# EAGLE design BusPirate-v4-final (EAGLE 5.06)
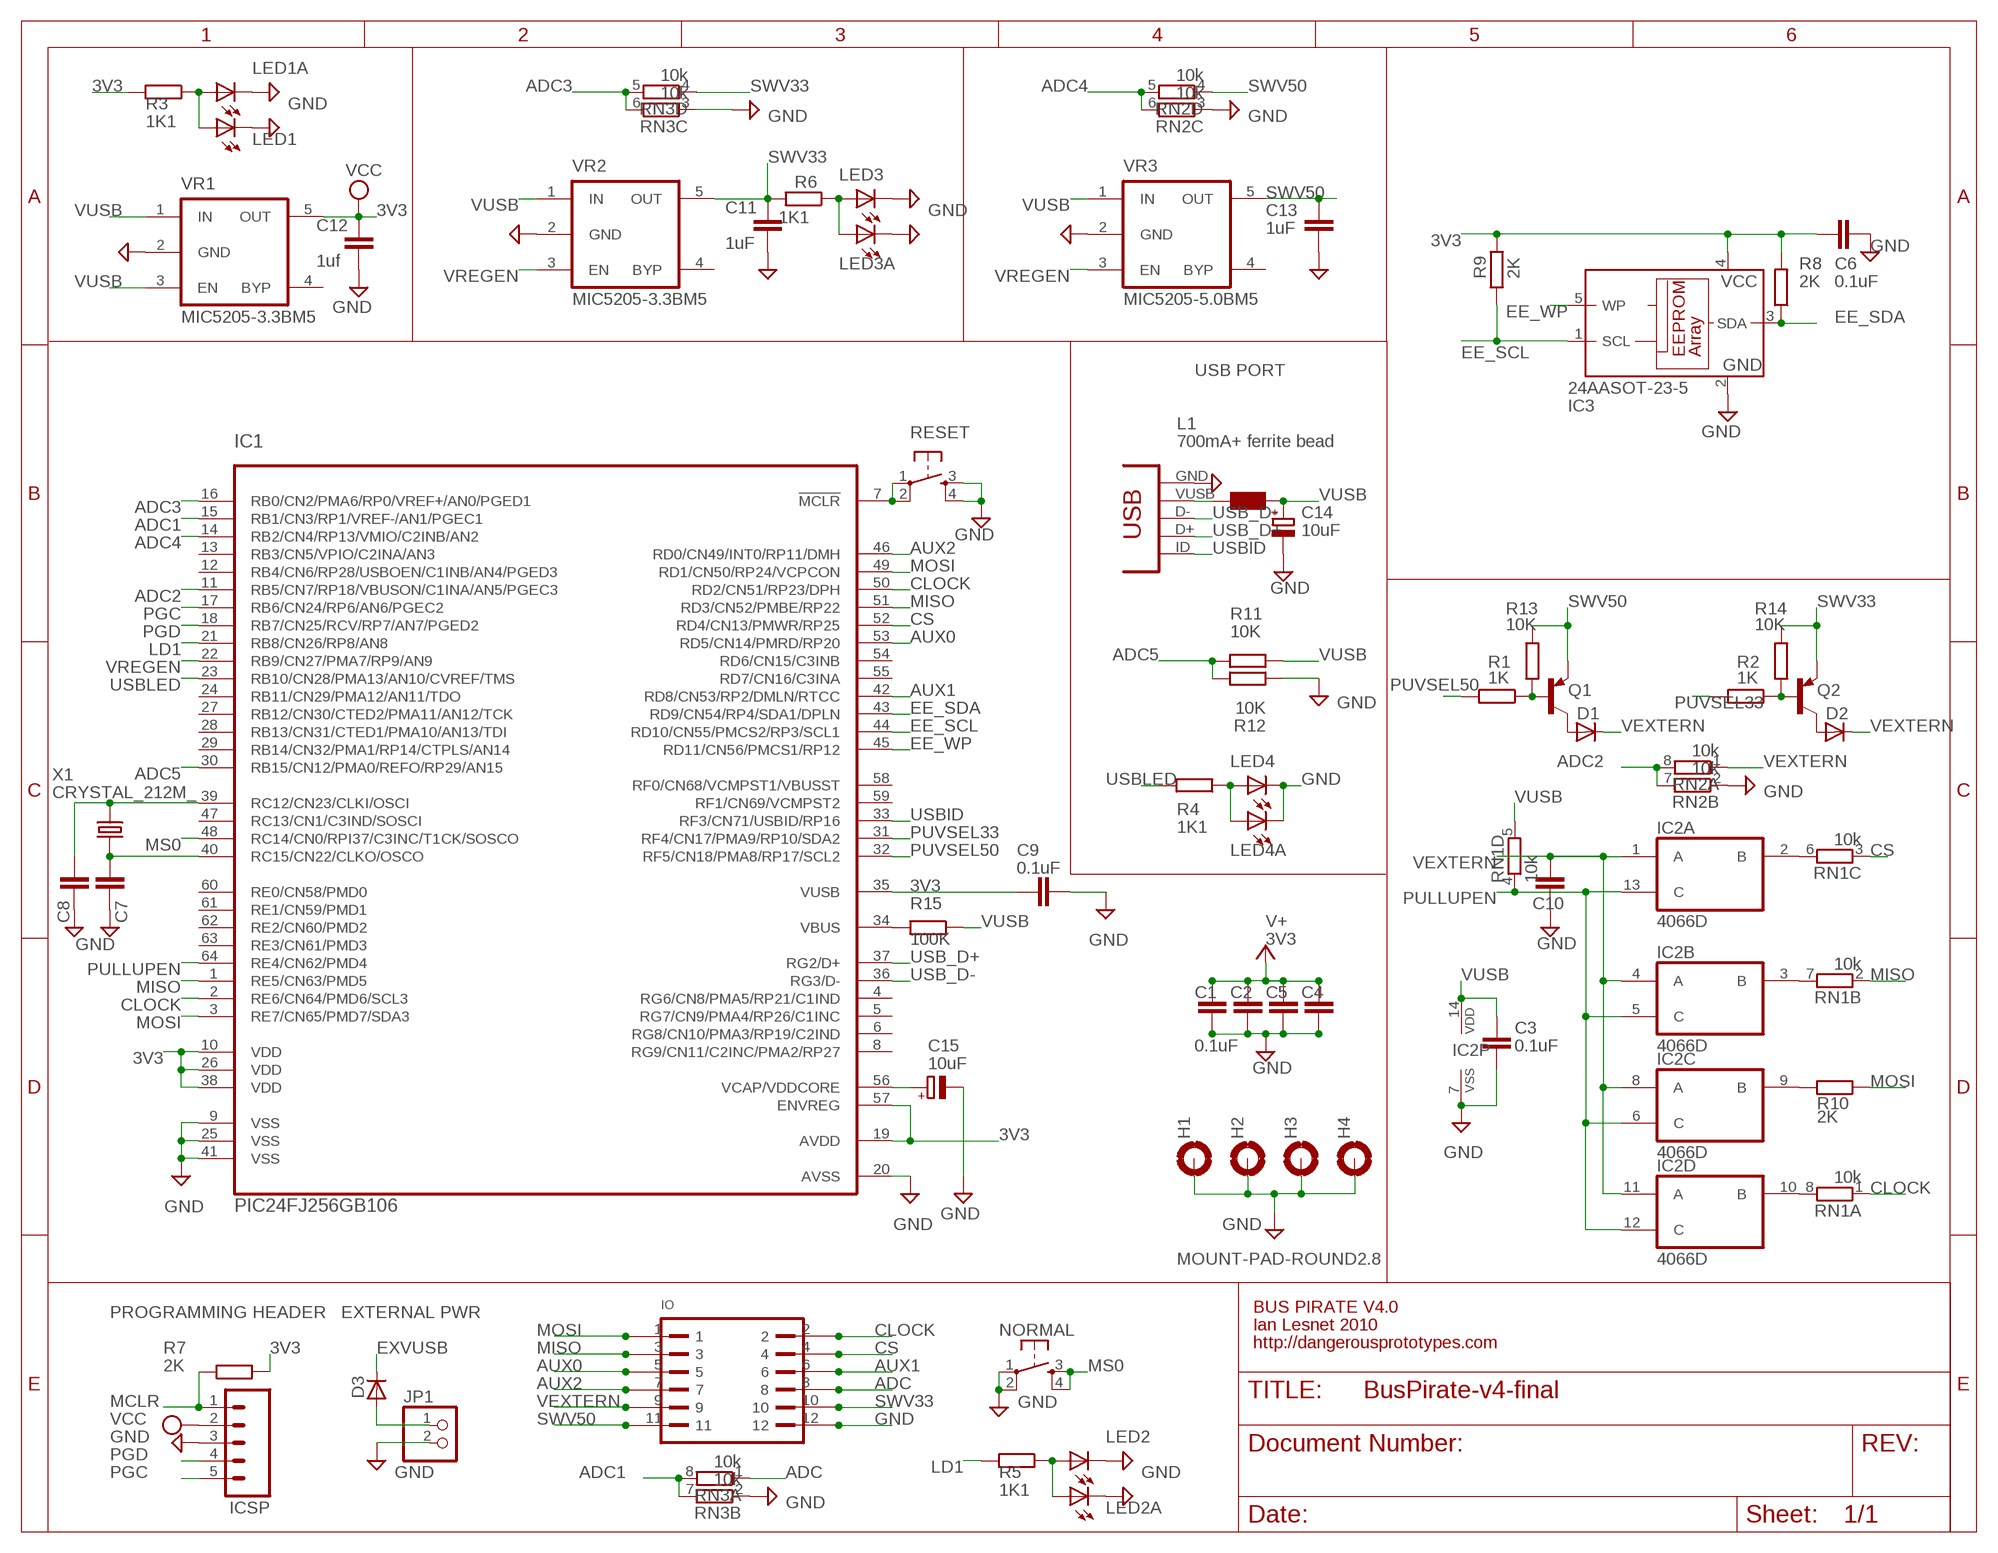
[diagram p0: schematic, sheet 1]

## Parts
C1  0.1uF  C-EUC0603  [C0603]
C2  0.1uF  C-EUC0603  [C0603]
C3  0.1uF  C-EUC0603  [C0603]
C4  0.1uF  C-EUC0603  [C0603]
C5  0.1uF  C-EUC0603  [C0603]
C6  0.1uF  C-EUC0603  [C0603]
C7  0.1uF  C-EUC0603  [C0603]
C8  0.1uF  C-EUC0603  [C0603]
C9  0.1uF  C-EUC0603  [C0603]
C10  0.1uF  C-EUC0603  [C0603]
C11  1uF  C-EUC0603  [C0603]
C12  1uf  C-EUC0603  [C0603]
C13  1uF  C-EUC0603  [C0603]
C14  10uF  CPOL-EUSMCA  [SMC_A]
C15  10uF  CPOL-EUSMCA  [SMC_A]
D1  MBR0520LT  [SOD123]
D2  MBR0520LT  [SOD123]
D3  MBR0520LT  [SOD123]
H1  MOUNT-PAD-ROUND2.8  [2,8-PAD]
H2  MOUNT-PAD-ROUND2.8  [2,8-PAD]
H3  MOUNT-PAD-ROUND2.8  [2,8-PAD]
H4  MOUNT-PAD-ROUND2.8  [2,8-PAD]
IC1  PIC24FJ256GB106  [TQFP64-10X10]
IC2  4066D  [SO14]
IC3  24AASOT-23-5  24AA  [SOT-23-5]
ICSP  ICSP  M05  [1X05]
IO  PINSHRD-PTH-2X06  [PINSHRD_PTH_2X06]
JP1  PINHD-1X02_2.54-S  [1X02-S]
L1  700mA+ ferrite bead  WE-KIL_0805  [WE-KI_0805_B]
LED1  LEDCHIP-LED0805  [CHIP-LED0805]
LED1A  LEDCHIP-LED0805  [CHIP-LED0805]
LED2  LEDCHIP-LED0805  [CHIP-LED0805]
LED2A  LEDCHIP-LED0805  [CHIP-LED0805]
LED3  LEDCHIP-LED0805  [CHIP-LED0805]
LED3A  LEDCHIP-LED0805  [CHIP-LED0805]
LED4  LEDCHIP-LED0805  [CHIP-LED0805]
LED4A  LEDCHIP-LED0805  [CHIP-LED0805]
NORMAL  SMD_TACT_SMALL  [TACT_SWITCH_SMALL]
Q1  MMBTA56-SOT23  [SOT23]
Q2  MMBTA56-SOT23  [SOT23]
R1  1K  R-EU_R0603  [R0603]
R2  1K  R-EU_R0603  [R0603]
R3  1K1  R-EU_R0603  [R0603]
R4  1K1  R-EU_R0603  [R0603]
R5  1K1  R-EU_R0603  [R0603]
R6  1K1  R-EU_R0603  [R0603]
R7  2K  R-EU_R0603  [R0603]
R8  2K  R-EU_R0603  [R0603]
R9  2K  R-EU_R0603  [R0603]
R10  2K  R-EU_R0603  [R0603]
R11  10K  R-EU_R0603  [R0603]
R12  10K  R-EU_R0603  [R0603]
R13  10K  R-EU_R0603  [R0603]
R14  10K  R-EU_R0603  [R0603]
R15  100K  R-EU_R0603  [R0603]
RESET  SMD_TACT_SMALL  [TACT_SWITCH_SMALL]
RN1  10k  RNETWORK  [RN8P-4R-CRA06S]
RN2  10k  RNETWORK  [RN8P-4R-CRA06S]
RN3  10k  RNETWORK  [RN8P-4R-CRA06S]
USB  USB mini-b  CONN_USB  [CONN_USB_MINI-B]
VR1  MIC5205-3.3BM5  MIC5205  [SOT-23-5]
VR2  MIC5205-3.3BM5  MIC5205  [SOT-23-5]
VR3  MIC5205-5.0BM5  MIC5205  [SOT-23-5]
X1  CRYSTAL_212M_  [4X6]

## Nets
3V3: C1.1 C2.1 C4.1 C5.1 C6.1 C9.1 C12.1 IC1.10(VDD) IC1.19(AVDD) IC1.26(VDD) IC1.35(VUSB) IC1.38(VDD) IC1.57(ENVREG) IC3.4(VCC) ICSP.2 R3.2 R7.2 R8.2 R9.2 VR1.5(OUT) ; supply symbol labelled VCC, V+
ADC: IO.8 RN3.1
ADC1: IC1.15(RB1/CN3/RP1/VREF-/AN1/PGEC1) RN3.7 RN3.8
ADC2: IC1.11(RB5/CN7/RP18/VBUSON/C1INA/AN5/PGEC3) RN2.7 RN2.8
ADC3: IC1.16(RB0/CN2/PMA6/RP0/VREF+/AN0/PGED1) RN3.5 RN3.6
ADC4: IC1.14(RB2/CN4/RP13/VMIO/C2INB/AN2) RN2.5 RN2.6
ADC5: IC1.30(RB15/CN12/PMA0/REFO/RP29/AN15) R11.2 R12.2
AUX0: IC1.53(RD5/CN14/PMRD/RP20) IO.5
AUX1: IC1.42(RD8/CN53/RP2/DMLN/RTCC) IO.6
AUX2: IC1.46(RD0/CN49/INT0/RP11/DMH) IO.7
CLOCK: IC1.2(RE6/CN64/PMD6/SCL3) IC1.50(RD2/CN51/RP23/DPH) IO.2 RN1.1
CS: IC1.52(RD4/CN13/PMWR/RP25) IO.4 RN1.3
EE_SCL: IC1.44(RD10/CN55/PMCS2/RP3/SCL1) IC3.1(SCL) R9.1
EE_SDA: IC1.43(RD9/CN54/RP4/SDA1/DPLN) IC3.3(SDA) R8.1
EE_WP: IC1.45(RD11/CN56/PMCS1/RP12) IC3.5(WP)
EXVUSB: D3.C L1.2 USB.VUSB
GND: C1.2 C2.2 C3.2 C4.2 C5.2 C6.2 C7.2 C8.2 C9.2 C10.2 C11.2 C12.2 C13.2 C14.- C15.- H1.B2,8(MOUNT) H2.B2,8(MOUNT) H3.B2,8(MOUNT) H4.B2,8(MOUNT) IC1.9(VSS) IC1.20(AVSS) IC1.25(VSS) IC1.41(VSS) IC2.7(P:VSS) IC3.2(GND) ICSP.3 IO.12 JP1.2 LED1.C LED1A.C LED2.C LED2A.C LED3.C LED3A.C LED4.C LED4A.C NORMAL.1 NORMAL.2 R12.1 RESET.3 RESET.4 RN2.2 RN2.3 RN3.2 RN3.3 USB.GND VR1.2(GND) VR2.2(GND) VR3.2(GND)
LD1: IC1.21(RB8/CN26/RP8/AN8) R5.2
MCLR: IC1.7(!MCLR) ICSP.1 R7.1 RESET.1 RESET.2
MISO: IC1.1(RE5/CN63/PMD5) IC1.51(RD3/CN52/PMBE/RP22) IO.3 RN1.2
MOSI: IC1.3(RE7/CN65/PMD7/SDA3) IC1.49(RD1/CN50/RP24/VCPCON) IO.1 R10.1
MS0: IC1.48(RC14/CN0/RPI37/C3INC/T1CK/SOSCO) NORMAL.3 NORMAL.4
N$1: IC2.9(C:B) R10.2
N$2: IC2.10(D:B) RN1.8
N$3: D1.A Q1.3(C)
N$4: IC2.2(A:B) RN1.6
N$5: IC2.3(B:B) RN1.7
N$6: LED2.A LED2A.A R5.1
N$7: LED1.A LED1A.A R3.1
N$8: Q2.1(B) R2.1 R14.2
N$9: C7.1 IC1.40(RC15/CN22/CLKO/OSCO) X1.2(X2)
N$10: C15.+ IC1.56(VCAP/VDDCORE)
N$11: IC1.34(VBUS) R15.2
N$12: C8.1 IC1.39(RC12/CN23/CLKI/OSCI) X1.1(X1)
N$13: LED4.A LED4A.A R4.1
N$14: D2.A Q2.3(C)
N$15: D3.A JP1.1
N$17: Q1.1(B) R1.1 R13.2
N$18: LED3.A LED3A.A R6.1
PGC: IC1.17(RB6/CN24/RP6/AN6/PGEC2) ICSP.5
PGD: IC1.18(RB7/CN25/RCV/RP7/AN7/PGED2) ICSP.4
PULLUPEN: IC1.64(RE4/CN62/PMD4) IC2.5(B:C) IC2.6(C:C) IC2.12(D:C) IC2.13(A:C) RN1.4
PUVSEL33: IC1.31(RF4/CN17/PMA9/RP10/SDA2) R2.2
PUVSEL50: IC1.32(RF5/CN18/PMA8/RP17/SCL2) R1.2
SWV33: C11.1 IO.10 Q2.2(E) R6.2 R14.1 RN3.4 VR2.5(OUT)
SWV50: C13.1 IO.11 Q1.2(E) R13.1 RN2.4 VR3.5(OUT)
USB_D+: IC1.37(RG2/D+) USB.D+
USB_D-: IC1.36(RG3/D-) USB.D-
USBID: IC1.33(RF3/CN71/USBID/RP16) USB.ID(USBID)
USBLED: IC1.23(RB10/CN28/PMA13/AN10/CVREF/TMS) R4.2
VEXTERN: C10.1 D1.C D2.C IC2.1(A:A) IC2.4(B:A) IC2.8(C:A) IC2.11(D:A) IO.9 RN2.1
VREGEN: IC1.22(RB9/CN27/PMA7/RP9/AN9) VR2.3(EN) VR3.3(EN)
VUSB: C3.1 C14.+ IC2.14(P:VDD) L1.1 R11.1 R15.1 RN1.5 VR1.1(IN) VR1.3(EN) VR2.1(IN) VR3.1(IN)
Unconnected: IC1.4(RG6/CN8/PMA5/RP21/C1IND) IC1.5(RG7/CN9/PMA4/RP26/C1INC) IC1.6(RG8/CN10/PMA3/RP19/C2IND) IC1.8(RG9/CN11/C2INC/PMA2/RP27) IC1.12(RB4/CN6/RP28/USBOEN/C1INB/AN4/PGED3) IC1.13(RB3/CN5/VPIO/C2INA/AN3) IC1.24(RB11/CN29/PMA12/AN11/TDO) IC1.27(RB12/CN30/CTED2/PMA11/AN12/TCK) IC1.28(RB13/CN31/CTED1/PMA10/AN13/TDI) IC1.29(RB14/CN32/PMA1/RP14/CTPLS/AN14) IC1.47(RC13/CN1/C3IND/SOSCI) IC1.54(RD6/CN15/C3INB) IC1.55(RD7/CN16/C3INA) IC1.58(RF0/CN68/VCMPST1/VBUSST) IC1.59(RF1/CN69/VCMPST2) IC1.60(RE0/CN58/PMD0) IC1.61(RE1/CN59/PMD1) IC1.62(RE2/CN60/PMD2) IC1.63(RE3/CN61/PMD3) USB.BODY@1(BODY) USB.BODY@2(BODY) USB.BODY@3(BODY) USB.BODY@4(BODY) VR1.4(BYP) VR2.4(BYP) VR3.4(BYP)

## Notes on the sheet
- USB PORT
- BUS PIRATE V4.0
- PROGRAMMING HEADER | EXTERNAL PWR
- Ian Lesnet 2010
- http://dangerousprototypes.com

## Library data of the parts
C1-C13 = rcl:C-EU: CAPACITOR, European symbol
C14 C15 = rcl:CPOL-EU: POLARIZED CAPACITOR, European symbol
D1-D3 = diode:MBR0520LT: SCHOTTKY BARRIER RECTIFIER Source: http://onsemi.com .. MBR0520LT1-D.pdf
H1-H4 = holes:MOUNT-PAD-ROUND: MOUNTING PAD, round
IC1 = dp_devices:PIC24FJ256GB106: 16-Bit Flash Microcontroller with USB On-The-Go(OTG)
IC2 = 40xx:4066: Quad bilateral ANALOG SWITCH
IC3 = dp_devices:24AA*; 24AA: 24AA
ICSP = SparkFun:M05: Header 5 Standard 5-pin 0.1" header. Use with straight break away headers (SKU : PRT-00116), right angle break away headers (PRT-00553), swiss pins (PRT-00743), machine pins (PRT-00117), and female headers (PRT-00115). Molex polarized connector foot print use with SKU : PRT-08230 with associated crimp pins and housings.
IO = dp_devices:PINSHRD-PTH-2X06: Shrouded pin header, 2.54mm pitch
JP1 = pinhead-2:PINHD-1X02: PIN HEADER
L1 = wuerth-elektronik:WE-KIL: SMD Wire Wound Ceramic Inductor WE-KIL - Low profile - High Q values -- Bluetooth -- Wireless LAN -- RF oscillation circuit -- IF impedance matching
LED1 LED1A LED2 LED2A LED3 LED3A LED4 LED4A = led:LED: LED OSRAM: - CHIPLED LG R971, LG N971, LY N971, LG Q971, LY Q971, LO R971, LY R971 LH N974, LH R974 LS Q976, LO Q976, LY Q976 LO Q996 - Hyper CHIPLED LW Q18S LB Q993, LB Q99A, LB R99A - SideLED LS A670, LO A670, LY A670, LG A670, LP A670 LB A673, LV A673, LT A673, LW A673 LH A674 LY A675 LS A676, LA A676, LO A676, LY A676, LW A676 LS A679, LY A679, LG A679 - Hyper Micro SIDELED® LS Y876, LA Y876, LO Y876, LY Y876 LT Y87S - SmartLED LW L88C, LW L88S LB L89C, LB L89S, LG L890 LS L89K, LO L89K, LY L89K LS L896, LA L896, LO L896, LY L896 - TOPLED LS T670, LO T670, LY T670, LG T670, LP T670 LSG T670, LSP T670, LSY T670, LOP T670, LYG T670 LG T671, LOG T671, LSG T671 LB T673, LV T673, LT T673, LW T673 LH T674 LS T676, LA T676, LO T676, LY T676, LB T676, LH T676, LSB T676, LW T676 LB T67C, LV T67C, LT T67C, LS T67K, LO T67K, LY T67K, LW E67C LS E67B, LA E67B, LO E67B, LY E67B, LB E67C, LV E67C, LT E67C LW T67C LS T679, LY T679, LG T679 LS T770, LO T770, LY T770, LG T770, LP T770 LB T773, LV T773, LT T773, LW T773 LH T774 LS E675, LA E675, LY E675, LS T675 LS T776, LA T776, LO T776, LY T776, LB T776 LHGB T686 LT T68C, LB T68C - Hyper Mini TOPLED® LB M676 - Mini TOPLED Santana® LG M470 LS M47K, LO M47K, LY M47K Source: http://www.osram.convergy.de LUXEON: - LUMILED® LXK2-PW12-R00, LXK2-PW12-S00, LXK2-PW14-U00, LXK2-PW14-V00 LXK2-PM12-R00, LXK2-PM12-S00, LXK2-PM14-U00 LXK2-PE12-Q00, LXK2-PE12-R00, LXK2-PE12-S00, LXK2-PE14-T00, LXK2-PE14-U00 LXK2-PB12-K00, LXK2-PB12-L00, LXK2-PB12-M00, LXK2-PB14-N00, LXK2-PB14-P00, LXK2-PB14-Q00 LXK2-PR12-L00, LXK2-PR12-M00, LXK2-PR14-Q00, LXK2-PR14-R00 LXK2-PD12-Q00, LXK2-PD12-R00, LXK2-PD12-S00 LXK2-PH12-R00, LXK2-PH12-S00 LXK2-PL12-P00, LXK2-PL12-Q00, LXK2-PL12-R00 Source: www.luxeon.com KINGBRIGHT: KA-3528ASYC Source: www.kingbright.com
NORMAL RESET = dp_devices:SMD_TACT_SMALL
Q1 Q2 = transistor-pnp:*-?: PNP Transistor
R1-R3 R5-R10 R13-R15 = rcl:R-EU_: RESISTOR, European symbol
R4 R11 R12 = resistor:R-EU_: RESISTOR, European symbol
RN1-RN3 = dp_devices:RNETWORK: 4 Resistor Array 0603
USB = dp_devices:CONN_USB: USB connector
VR1-VR3 = dp_devices:MIC5205: 150ma Low-Noise LDO Regulator
X1 = dp_devices:CRYSTAL_2

## Board
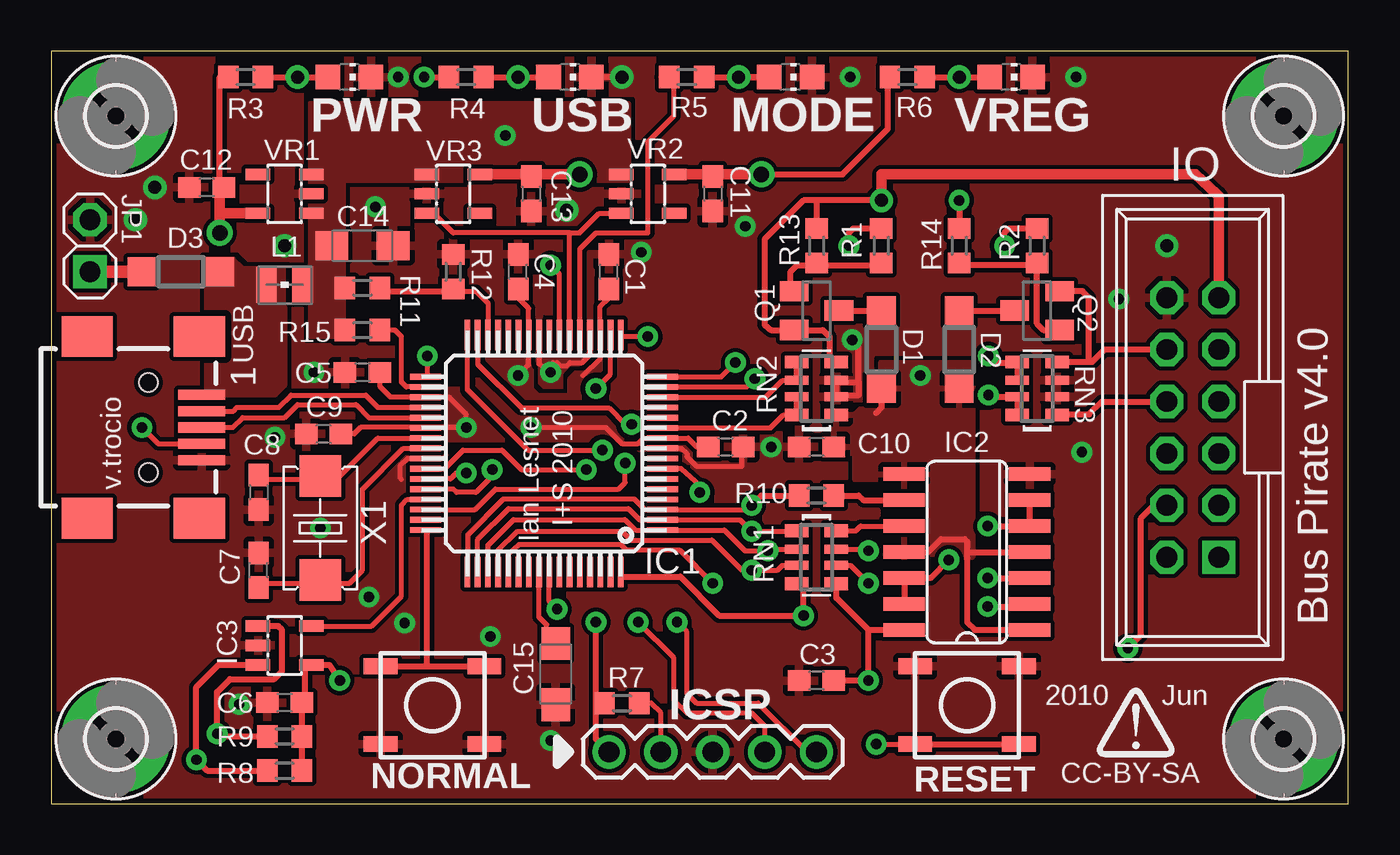
[diagram p1: board, top side]
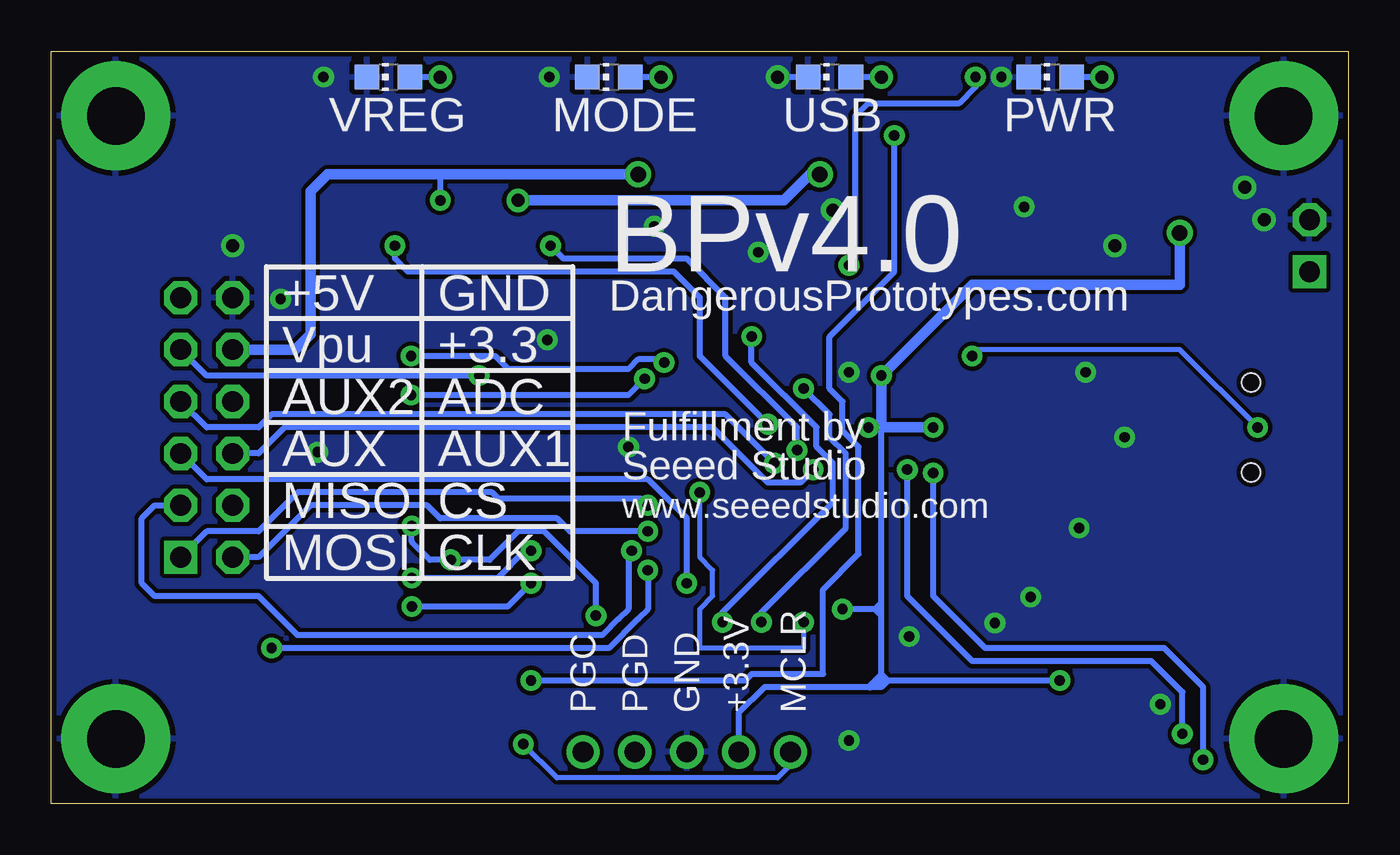
[diagram p2: board, bottom side, seen from below]

Size 63.5 x 36.83 mm. Coordinates in mm from the lower left corner, seen from the top.
Outline: 0,36.83 0,0 63.5,0 63.5,36.83 0,36.83
Copper layers (1*16): Top 0.035mm / dielectric 1.5mm / Bottom 0.035mm
Design rules "SparkFun": minimum track width 8mil, minimum drill 20mil, track to track 8mil, track to pad 8mil, pad to pad 8mil, via to via 8mil, smd to smd 8mil, copper to edge 10mil, drill to drill 8mil, minimum pad ring 12mil, minimum via ring 10mil, stop-mask expansion 4mil, vias tented up to drill 25mil, thermal gap 10mil

### Footprints (pad centres in the part's own frame; a part is rotated, then mirrored left to right if it is on the bottom)
C0603 = smd 1.1 x 1: 1 -0.85,0; 2 0.85,0
SMC_A = smd 1.6 x 1.4: + -1.5,0; - 1.5,0
SOD123 = smd 1.4 x 1.4: A 1.9,0; C -1.9,0
2,8-PAD = drill 2.8 pad 5.334 round: B2,8 0,0
TQFP64-10X10 = smd 1.5 x 0.28: 1 -5.8,3.75; 2 -5.8,3.25; 3 -5.8,2.75; 4 -5.8,2.25; 5 -5.8,1.75; 6 -5.8,1.25; 7 -5.8,0.75; 8 -5.8,0.25; 9 -5.8,-0.25; 10 -5.8,-0.75; 11 -5.8,-1.25; 12 -5.8,-1.75; 13 -5.8,-2.25; 14 -5.8,-2.75; 15 -5.8,-3.25; 16 -5.8,-3.75; 33 5.8,-3.75; 34 5.8,-3.25; 35 5.8,-2.75; 36 5.8,-2.25; 37 5.8,-1.75; 38 5.8,-1.25; 39 5.8,-0.75; 40 5.8,-0.25; 41 5.8,0.25; 42 5.8,0.75; 43 5.8,1.25; 44 5.8,1.75; 45 5.8,2.25; 46 5.8,2.75; 47 5.8,3.25; 48 5.8,3.75 | smd 0.28 x 1.5: 17 -3.75,-5.8; 18 -3.25,-5.8; 19 -2.75,-5.8; 20 -2.25,-5.8; 21 -1.75,-5.8; 22 -1.25,-5.8; 23 -0.75,-5.8; 24 -0.25,-5.8; 25 0.25,-5.8; 26 0.75,-5.8; 27 1.25,-5.8; 28 1.75,-5.8; 29 2.25,-5.8; 30 2.75,-5.8; 31 3.25,-5.8; 32 3.75,-5.8; 49 3.75,5.8; 50 3.25,5.8; 51 2.75,5.8; 52 2.25,5.8; 53 1.75,5.8; 54 1.25,5.8; 55 0.75,5.8; 56 0.25,5.8; 57 -0.25,5.8; 58 -0.75,5.8; 59 -1.25,5.8; 60 -1.75,5.8; 61 -2.25,5.8; 62 -2.75,5.8; 63 -3.25,5.8; 64 -3.75,5.8
SO14 = smd 0.66 x 2.032: 1 -3.81,-3.073; 2 -2.54,-3.073; 3 -1.27,-3.073; 4 0,-3.073; 5 1.27,-3.073; 6 2.54,-3.073; 7 3.81,-3.073; 8 3.81,3.073; 9 2.54,3.073; 10 1.27,3.073; 11 0,3.073; 12 -1.27,3.073; 13 -2.54,3.073; 14 -3.81,3.073
SOT-23-5 = smd 0.55 x 1.2: 1 -0.95,-1.3; 2 0,-1.3; 3 0.95,-1.3; 4 0.95,1.3; 5 -0.95,1.3
1X05 = drill 1.016 round: 1 0,0; 2 2.54,0; 3 5.08,0; 4 7.62,0; 5 10.16,0
PINSHRD_PTH_2X06 = drill 1.016 square: 1 -6.35,-1.27 | drill 1.016 octagon: 2 -6.35,1.27; 3 -3.81,-1.27; 4 -3.81,1.27; 5 -1.27,-1.27; 6 -1.27,1.27; 7 1.27,-1.27; 8 1.27,1.27; 9 3.81,-1.27; 10 3.81,1.27; 11 6.35,-1.27; 12 6.35,1.27
1X02-S = drill 1.016 square: 1 -1.27,0 | drill 1.016 octagon: 2 1.27,0
WE-KI_0805_B = smd 1.02 x 1.78: 1 -0.89,0; 2 0.89,0
CHIP-LED0805 = smd 1.2 x 1.2: A 0,-1.05; C 0,1.05
TACT_SWITCH_SMALL = smd 1.651 x 0.762: 1 -2.54,1.905; 2 2.54,1.905; 3 -2.54,-1.905; 4 2.54,-1.905
SOT23 = smd 1 x 1.4: 1 -0.95,-1.1; 2 0.95,-1.1; 3 0,1.1
R0603 = smd 1 x 1.1: 1 -0.85,0; 2 0.85,0
RN8P-4R-CRA06S = smd 0.63 x 1.15: 1 -1.295,-0.975; 4 1.295,-0.975; 5 1.295,0.975; 8 -1.295,0.975 | smd 0.44 x 1.15: 2 -0.4,-0.975; 3 0.4,-0.975; 6 0.4,0.975; 7 -0.4,0.975
CONN_USB_MINI-B = smd 2 x 2.5: BODY@1 -4.45,2.5; BODY@2 4.45,2.5; BODY@3 4.45,-3; BODY@4 -4.45,-3 | smd 0.5 x 2.3: D+ 0,2.6; D- -0.8,2.6; GND 1.6,2.6; ID 0.8,2.6; VUSB -1.6,2.6 | hole 0.9: -2.2,0; 2.2,0
4X6 = smd 2.032 x 2.032: 1 -2.54,0; 2 2.54,0

### Placement (x,y rotation side)
C1  27.3,26.04 90 top
C2  33.02,17.46 0 top
C3  37.46,6.03 180 top
C4  22.86,26.04 90 top
C5  15.24,21.11 180 top
C6  11.43,4.95 180 top
C7  10.16,11.43 90 top
C8  10.16,15.24 270 top
C9  13.34,18.1 180 top
C10  37.46,17.46 180 top
C11  32.38,29.85 270 top
C12  7.62,30.16 180 top
C13  23.49,29.85 270 top
C14  15.24,27.31 0 top
C15  24.7,6.35 270 top
D1  40.64,22.23 90 top
D2  44.45,22.23 90 top
D3  6.35,26.04 180 top
H1  3.17,3.17 0 top
H2  60.32,3.17 0 top
H3  60.32,33.66 0 top
H4  3.17,33.66 0 top
IC1  24.13,17.15 180 top
IC2  44.83,12.32 90 top
IC3  11.43,7.75 270 top
ICSP  27.3,2.54 0 top
IO  55.88,18.42 90 top
JP1  1.91,27.31 90 top
L1  11.43,25.4 180 top
LED1  14.61,35.56 270 top
LED1A  14.61,35.56 90 bottom
LED2  36.2,35.56 270 top
LED2A  36.2,35.56 90 bottom
LED3  46.99,35.56 270 top
LED3A  46.99,35.56 90 bottom
LED4  25.4,35.56 270 top
LED4A  25.4,35.56 90 bottom
NORMAL  18.67,4.83 180 top
Q1  37.46,24.13 270 top
Q2  48.26,24.13 90 top
R1  40.64,27.31 90 top
R2  48.26,27.31 90 top
R3  9.53,35.56 180 top
R4  20.32,35.56 180 top
R5  31.12,35.56 180 top
R6  41.91,35.56 180 top
R7  27.94,4.92 0 top
R8  11.43,1.62 0 top
R9  11.43,3.3 0 top
R10  37.46,15.08 0 top
R11  15.24,25.24 0 top
R12  19.68,26.04 270 top
R13  37.46,27.31 270 top
R14  44.45,27.31 270 top
R15  15.24,23.18 0 top
RESET  44.83,4.83 180 top
RN1  37.46,12.06 270 top
RN2  37.46,20.32 90 top
RN3  48.26,20.32 90 top
U$1  [DP-LOGO]  51.18,2.29 0 top
USB  4.76,18.42 270 top
VR1  11.43,29.85 90 top
VR2  29.21,29.85 270 top
VR3  19.68,29.85 270 top
X1  13.18,13.49 270 top

### Tracks (layer width: path | path; a pad name or v marks a point on that pad's centre or on a via)
3V3  (via drill 0.51, 0.76)
  Top 0.254: 16.03,20.96 C5.1 16.11,21.09 16.11,20.4 16.62,19.9 IC1.35 19.47,19.9 20.32,19.05 v20.32,18.42 | C1.1 27.3,24.77 26.88,24.34 IC1.19 26.88,21.76 26.04,20.96 | C4.1 22.86,24.77 23.38,24.25 IC1.26 23.38,21.48 v22.86,20.96 | C2.1 31.59,17.46 31.18,17.9 IC1.10 29.01,17.9 28.73,17.62 27.94,17.62 27.15,18.42 v23.49,18.42 | R7.2 29.37,4.92 29.84,4.45 ICSP.2 | C9.1 14.84,18.1 15.16,18.42 20.16,18.42 v20.32,18.42 | IC1.38 20.14,18.4 v20.32,18.42 | IC1.57 24.38,9.91 v24.77,9.53
  Top 0.305: 8.89,35.56 R3.2 8.26,35.56 8.26,30.16 | v14.13,6.03 13.62,6.8 IC3.4 12.45,6.77 12.45,5.21 12.28,5.04 C6.1 R9.2 | R9.2 | R8.2 R9.2
  Top 0.508: v8.26,27.94 8.26,28.26 8.25,28.9 VR1.5 8.54,28.89 8.26,28.89 8.26,30.16 C12.1
  Bottom 0.305: 22.86,9.53 22.86,9.84 | 22.86,9.84 22.86,18.42 | v14.13,6.03 22.54,6.03 | 22.54,6.03 22.86,6.03 | ICSP.2 29.84,4.45 28.57,5.71 23.49,5.71 | 22.86,5.71 23.18,5.71 | 23.18,5.71 23.34,5.71 | 22.86,9.53 23.18,9.53 | 23.18,9.53 v24.77,9.53 | 22.86,6.03 22.86,6.19 | 22.86,6.35 22.86,6.19 | 22.86,6.35 22.86,9.21 | 22.86,9.21 22.86,9.53 | 22.86,6.03 22.86,5.71 | 22.86,6.03 23.18,5.71 | 22.54,6.03 22.86,6.35 | 22.54,6.03 22.86,5.71 | 22.86,6.19 23.34,5.71 | 23.49,5.71 23.34,5.71 | 22.86,6.35 23.49,5.71 | 23.18,9.53 22.86,9.84 | 22.86,9.21 23.18,9.53
  Bottom 0.508: v8.26,27.94 8.26,25.4 18.41,25.4 v22.86,20.96 | 22.86,18.42 v22.86,20.96 | 22.86,18.42 v20.32,18.42 | v22.86,20.96 | 22.86,18.42 v23.49,18.42 | 22.86,18.42 v22.86,20.96
  pour Top (isolate 0.254, no thermals): 20.32,24.13 22.86,24.13 23.49,23.5 23.49,20.32 23.81,20 25.4,20 25.4,20.8 26.19,21.59 28.57,21.59 28.57,17.78 18.41,17.78 18.41,20.32 20.32,20.32
ADC
  Top 0.305: IO.8 51.44,19.69 50.8,19.05 49.53,19.05 49.5,19.03 RN3.1
ADC1  (via drill 0.51)
  Top 0.254: IC1.15 34.05,20.4 v34.45,20.8
  Top 0.305: RN3.8 RN3.7 45.96,19.92 v45.88,20
  Bottom 0.305: v45.88,20 35.24,20 v34.45,20.8 | v34.45,20.8
ADC2
  Top 0.254: IC1.11 35.22,18.4 35.85,19.03 RN2.8 RN2.7
ADC3  (via drill 0.51)
  Top 0.254: IC1.16 32.8,20.9 v33.5,21.59
  Top 0.305: 47.56,21.59 47.31,21.59 RN3.5 | RN3.5 RN3.6 | RN3.5 | RN3.5 47.01,21.61 46.99,21.59 46.2,21.59 v45.88,21.91
  Bottom 0.305: v33.5,21.59 | v33.5,21.59 33.66,21.75 34.77,21.75 35.24,21.27 41.12,21.27 41.75,21.91 v45.88,21.91
ADC4
  Top 0.254: RN2.5 RN2.6 35.8,20.72 34.98,19.9 IC1.14
ADC5
  Top 0.254: IC1.30 21.38,24.5 20.8,25.08 19.79,25.08 R12.2
  Top 0.305: R11.2 16.09,25.19 16.19,25.08 19.58,25.08 R12.2
AUX0  (via drill 0.51)
  Top 0.254: IC1.53 22.38,12.22 22.9,12.7 27.86,12.7 28.14,12.42 30.76,12.42 v32.38,10.79
  Bottom 0.305: v32.38,10.79 32.38,13.97 34.29,15.88 55.88,15.88 IO.5
AUX1  (via drill 0.51)
  Top 0.254: IC1.42 19.25,16.39 20.16,17.3 22.07,17.3 23.02,16.35 v26.19,16.35
  Bottom 0.305: IO.6 53.34,17.15 52.07,18.42 31.12,18.42 28.42,15.72 26.83,15.72 v26.19,16.35
AUX2  (via drill 0.51)
  Top 0.254: IC1.46 20.74,14.39 21.75,15.4 27.78,15.4 28.1,15.72 v28.1,16.67
  Bottom 0.305: IO.7 55.88,18.42 53.34,18.42 52.7,19.05 30.48,19.05 v28.1,16.67
CLOCK  (via drill 0.51)
  Top 0.254: IC1.50 20.88,12.94 22.38,14.45 28.26,14.45 28.81,13.89 IC1.2 33.73,13.89 v34.29,13.33 36.04,13.33 36.06,13.36 RN1.1 36.39,13.27 36.27,13.27 36.2,13.33
  Bottom 0.305: v34.29,13.33 38.1,13.33 38.73,13.97 44.45,13.97 45.09,14.61 50.8,14.61 53.34,12.06 IO.2
CS  (via drill 0.51)
  Top 0.254: IC1.52 21.88,12.43 22.82,13.33 27.94,13.33 28.38,12.9 32.34,12.9 33.81,11.43 v34.29,11.43 35.56,11.43 35.8,11.66 RN1.3
  Top 0.305: IO.4 53.98,14.61 53.34,13.97 53.34,8.26 v52.7,7.62
  Bottom 0.305: v52.7,7.62 36.2,7.62 34.77,9.05 | 34.77,9.05 | 34.77,9.05 34.29,9.53 v34.29,11.43
EE_SCL  (via drill 0.51)
  Top 0.254: IC1.44 19.69,15.39 19.84,15.24 20.8,15.24 21.59,16.03 v21.59,16.35
  Top 0.305: R9.1 8.26,3.3 v8.13,3.43 8.13,5.46 8.76,6.1 10.92,6.1 11.3,6.48 11.3,8.51 11.12,8.7 IC3.1
  Bottom 0.305: v8.13,3.43 8.13,5.46 9.65,6.98 18.41,6.98 21.59,10.16 v21.59,16.35
EE_SDA  (via drill 0.51)
  Top 0.254: IC1.43 19.55,15.89 19.84,16.19 v20.32,16.19
  Top 0.305: R8.1 7.65,1.62 v7.11,2.16 7.11,5.71 8.19,6.8 IC3.3
  Bottom 0.305: v7.11,2.16 7.11,5.71 9.02,7.62 17.78,7.62 20.32,10.16 v20.32,16.19
EE_WP
  Top 0.254: IC1.45 17.43,14.89 17.14,14.61 17.14,10.16 15.68,8.7 IC3.5
EXVUSB
  pour Top (isolate 0.305, no thermals): 7.62,21.59 8.89,21.59 8.89,24.13 7.62,24.13 7.62,26.67 8.89,26.67 9.37,26.19 11.43,26.19 11.43,20.48 10.95,20 7.62,20
GND  (via drill 0.51, 0.64)
  Top 0.254: IC1.25 23.88,21.52 v24.45,21.11 24.45,21.47 24.57,21.59 24.77,21.59 24.92,21.43 25.24,21.43 25.4,21.59 25.99,21.59 26.38,21.98 IC1.20 | IC1.41 17.45,16.9 17.07,16.51 17.07,15.95 17.14,15.88 | IC1.9 30.87,17.4 31.12,17.15 31.12,16.99 31.59,16.51 33.81,16.51 33.81,17.41 C2.2
  Top 0.305: v39.21,22.7 39.53,22.7 39.53,20.64 | 39.53,20.64 39.53,20 38.42,20 38.42,20.64 39.53,20.64 | v27.94,35.56 LED4A.C
  Top 0.406: LED4A.C 26.04,35.56
  Bottom 0.254: LED4A.C 26.35,35.56
  Bottom 0.305: LED4A.C v27.94,35.56
  other vias: 50.45,17.21 50.16,35.56 33.97,28.26 39.12,35.56 15.88,29.21 16.99,35.56 28.89,26.99 5.08,30.16 54.61,27.31 35.24,17.46 25.24,29.05 12.86,21.11 11.43,27.31 21.49,8.19 10.95,17.94 13.18,13.49 15.56,10.12 24.45,3.1 4.13,28.58 17.3,8.85 52.26,24.7 9.21,4.87
  pour Top (isolate 0.203, rank 2): 0,36.83 63.5,36.83 63.5,0 0,0
  pour Bottom (isolate 0.203, rank 2): 0,36.83 63.5,36.83 arc-3 63.5,0 0,0
LD1
  Top 0.254: IC1.21 25.88,27.15 26.67,27.94 29.21,27.94 29.21,32.38 30.48,33.66 30.48,35.22 R5.2 29.84,35.56
MCLR  (via drill 0.51)
  Top 0.254: IC1.7 30.84,16.39 31.75,15.56 v31.75,15.24 | R7.1 26.83,4.92 26.67,5.08 | v40.39,2.92 RESET.2
  Top 0.305: v26.67,8.89 26.67,5.08 26.67,3.17 ICSP.1 | RESET.2 RESET.1
  Bottom 0.254: v31.75,15.24 31.75,12.06 31.12,11.43 31.12,10.16 31.75,9.53 31.75,7.62 26.67,7.62 v26.67,8.89 | v40.39,2.92 38.73,1.27 27.94,1.27 27.3,1.91 ICSP.1
MISO  (via drill 0.51)
  Top 0.254: IC1.51 21.38,12.66 22.63,13.91 28.08,13.91 28.59,13.39 IC1.1 32.96,13.39 33.97,12.38 v35.08,12.38 35.17,12.46 RN1.2
  Bottom 0.305: IO.3 58.42,14.61 59.05,13.97 59.05,10.79 58.42,10.16 53.34,10.16 51.44,8.26 36.51,8.26 35.72,9.05 | 35.72,9.05 | 35.72,9.05 35.24,9.53 35.24,12.22 v35.08,12.38
MOSI  (via drill 0.51)
  Top 0.254: v34.29,14.61 34.08,14.39 IC1.3 29.06,14.39 28.54,14.92 22.15,14.92 20.4,13.18 20.4,11.39 20.38,11.33 IC1.49
  Top 0.305: R10.1 34.77,15.08 v34.29,14.61
  Bottom 0.305: IO.1 55.88,13.33 53.34,13.33 51.44,15.24 41.91,15.24 41.59,14.92 34.61,14.92 v34.29,14.61
MS0
  Top 0.254: 18.41,13.38 18.34,13.38 IC1.48
  Top 0.305: NORMAL.4 18.41,6.73 | 18.41,6.73 NORMAL.3 | 18.41,6.73 18.41,13.38
N$1
  Top 0.305: IC2.9 39.75,14.86 39.53,15.08 R10.2
N$2
  Top 0.254: IC2.10 39.62,13.59 39.39,13.36 RN1.8
N$3
  Top 0.305: Q1.3 D1.A
N$4  (via drill 0.51)
  Top 0.254: 47.78,9.65 IC2.2 | RN1.6 39.13,11.66 v40,10.79
  Top 0.305: v45.85,9.65 47.78,9.65
  Bottom 0.305: v45.85,9.65 41.15,9.65 v40,10.79
N$5  (via drill 0.51)
  Top 0.254: IC2.3 47.78,10.92 | RN1.7 39.92,12.46 v40,12.38
  Top 0.305: v45.85,11.05 IC2.3
  Bottom 0.305: v45.85,11.05 41.66,11.05 40.32,12.38 v40,12.38
N$6  (via drill 0.64)
  Top 0.305: v33.66,35.56 LED2A.A R5.1
  Top 0.406: R5.1 32.1,35.53
  Bottom 0.305: v33.66,35.56 LED2A.A
N$7  (via drill 0.64)
  Top 0.305: LED1A.A v12.07,35.56 R3.1
  Bottom 0.305: v12.07,35.56 LED1A.A
N$8
  Top 0.305: Q2.1 48.57,23.18 48.26,23.5 48.26,26.35 | 48.26,26.35 R2.1 | 48.26,26.35 44.55,26.35 R14.2
N$9
  Top 0.254: C7.1 10.38,10.79 12.7,10.79 12.86,10.95 X1.2 13.34,10.79 14.61,10.79 15.24,11.43 15.24,15.4 17.24,17.4 IC1.40
N$10
  Top 0.254: IC1.56 23.88,9.14 24.26,8.76 24.26,8.29 C15.+
N$11
  Top 0.254: IC1.34 17.39,20.4 17.14,20.64 17.14,22.86 16.83,23.18 R15.2
N$12
  Top 0.254: C8.1 10.16,15.88 | 10.16,15.88 | 10.16,15.88 13.02,15.88 X1.1 13.34,15.88 13.97,15.88 15.99,17.9 IC1.39
N$13  (via drill 0.64)
  Top 0.305: R4.1 v22.86,35.56 LED4A.A
  Bottom 0.305: v22.86,35.56 LED4A.A
N$14
  Top 0.305: Q2.3 D2.A
N$15
  Top 0.61: JP1.1 D3.A
N$17
  Top 0.305: R1.1 40.64,26.35 37.57,26.35 | 37.57,26.35 R13.2 | 37.57,26.35 36.51,26.35 36.2,26.04 36.2,25.25 Q1.1
N$18  (via drill 0.64)
  Top 0.305: LED3A.A v44.45,35.56 R6.1
  Top 0.406: LED3A.A 46.04,35.59
  Bottom 0.305: v44.45,35.56 LED3A.A
PGC  (via drill 0.51)
  Top 0.254: 27.94,22.86 27.92,22.85 | v29.21,22.86 27.94,22.86 | 36.99,2.54 34.61,4.92 31.59,4.92 31.12,5.4 31.12,8.41 v30.64,8.89 | 27.94,22.86 27.94,22.89 IC1.17
  Top 0.305: 36.99,2.54 ICSP.5
  Bottom 0.305: v29.21,22.86 29.21,21.59 26.04,18.42 26.04,17.46 25.24,16.67 25.24,14.76 30.64,9.37 v30.64,8.89
PGD  (via drill 0.51)
  Top 0.254: v26.67,20.32 27.38,21.03 IC1.18 | 34.92,2.7 34.92,3.81 34.29,4.45 31.12,4.45 30.48,5.08 30.48,7.14 v28.73,8.89
  Top 0.305: 34.92,2.7 ICSP.4
  Bottom 0.305: v26.67,20.32 25.4,19.05 25.4,17.94 24.61,17.15 24.61,13.49 28.73,9.37 v28.73,8.89
PULLUPEN  (via drill 0.51)
  Top 0.254: IC2.5 48.03,13.72 | 42.67,11.05 IC2.12 | IC1.64 27.88,11.17 27.94,11.11
  Top 0.305: IC2.12 IC2.13 | IC2.6 IC2.5 v45.85,13.59 | 42.67,11.05 43.05,11.05 v43.94,11.94 | 27.94,11.11 30.8,11.11 32.7,9.21 v36.83,9.21 | v36.83,9.21 36.84,9.22 | RN1.4 36.8,10.77 36.83,10.79 v36.83,9.21
  Bottom 0.305: v36.83,9.21 36.83,10.79 39.37,13.33 40.64,13.33 42.04,11.94 v43.94,11.94 44.96,11.94 45.85,12.83 v45.85,13.59
PUVSEL33  (via drill 0.51)
  Top 0.254: IC1.31 20.88,21.51 23.02,19.37 27.3,19.37 28.1,18.57 v28.42,18.57
  Top 0.305: R2.2 46.89,28.16 46.67,27.94 v46.67,27.31
  Bottom 0.305: v46.67,27.31 46.67,26.67 46.04,26.04 33.02,26.04 31.75,24.77 31.75,21.91 v28.42,18.57
PUVSEL50  (via drill 0.51)
  Top 0.254: IC1.32 20.38,20.26 23.34,17.3 v26.99,17.3
  Top 0.305: R1.2 39.27,28.16 39.05,27.94 v39.05,27.31
  Bottom 0.305: v26.99,17.3 26.99,18.42 30.48,21.91 30.48,24.77 32.38,26.67 38.42,26.67 v39.05,27.31
SWV33  (via drill 0.51, 0.76)
  Top 0.305: v34.77,30.8 38.73,30.8 40.96,33.02 40.96,35.46 R6.2 | v44.45,29.53 R14.1 | 50.95,21.62 RN3.4 | 50.95,21.62 51.56,22.23 IO.10 | Q2.2 50.48,25.08 50.8,24.77 50.8,21.77 50.95,21.62
  Top 0.406: R6.2 40.96,35.56
  Top 0.508: 33.02,30.8 VR2.5 | 33.02,30.8 C11.1 | 33.02,30.8 v34.77,30.8
  Bottom 0.305: 44.45,30.8 v44.45,29.53
  Bottom 0.508: v34.77,30.8 44.45,30.8 49.98,30.8 50.8,29.97 50.8,25.02 50.8,22.99 51.56,22.23 IO.10
SWV50  (via drill 0.64, 0.76)
  Top 0.305: v40.64,29.53 37.46,29.53 | 37.46,29.53 36.83,29.53 34.92,27.62 34.92,23.43 35.24,23.18 Q1.2 37.78,23.18 38.1,22.86 38.1,21.59 38.41,21.59 RN2.4 38.55,21.62 38.58,21.59 | 37.46,29.53 R13.1
  Top 0.508: VR3.5 23.39,30.8 C13.1 23.6,30.8 v25.88,30.8 | v40.64,29.53 40.64,30.8 56.01,30.8 57.02,29.85 57.15,29.72 IO.11
  Bottom 0.508: v40.64,29.53 27.62,29.53 26.35,30.8 v25.88,30.8
USB_D+
  Top 0.254: USB.D+ 8.89,18.42 9.37,18.9 9.37,18.89 11.43,18.89 12.07,19.53 14.92,19.53 15.55,18.9 IC1.37
USB_D-
  Top 0.254: USB.D- 8.93,19.21 9.11,19.4 11.14,19.4 11.75,20 15.4,20 15.99,19.41 16.01,19.4 IC1.36
USBID  (via drill 0.51)
  Top 0.254: USB.ID 5.25,17.62 v4.44,18.42 | v18.41,21.91 18.41,20.98 IC1.33
  Bottom 0.254: v4.44,18.42 8.26,22.23 18.1,22.23 v18.41,21.91
USBLED  (via drill 0.51)
  Top 0.254: IC1.23 24.88,25.92 v24.45,26.35
  Top 0.305: v18.26,35.56 R4.2
  Bottom 0.254: v24.45,26.35 24.13,26.67
  Bottom 0.305: 24.13,26.67 24.13,33.66 23.49,34.29 19.05,34.29 18.26,35.08 v18.26,35.56
VEXTERN  (via drill 0.51)
  Top 0.254: IC2.8 41.78,16.15
  Top 0.305: IC2.1 45.21,8.51 44.83,8.89 44.83,12.32 | 44.83,12.32 44.83,12.83 44.7,12.95 43.56,12.95 42.93,12.32 IC2.11 | 44.83,12.32 IC2.4 | D2.C | D1.C 40.64,19.37 40.39,19.12 | 42.16,16.28 41.91,16.28 IC2.8
  Bottom 0.305: IO.9 55.88,20.96 v42.55,20.96
  pour Top: 38.1,19.05 39.37,19.05 40.64,20.32 40.64,21.59 45.09,21.59 45.09,12.06 40.64,12.06 40.64,15.88 39.37,15.88 39.37,17.15 38.1,17.15
VREGEN
  Top 0.254: VR3.3 18.73,28.9 19.68,27.94 25.4,27.94 | 25.4,27.94 25.88,27.94 26.83,28.89 VR2.3 | IC1.22 25.38,27.92 25.4,27.94
VUSB  (via drill 0.51)
  Top 0.254: 41.66,8.51 IC2.14
  Top 0.305: 41.7,8.45 IC2.14 41.53,8.51 | C3.1 v40,6.03 40,8.51 | 40,8.51 41.27,8.51 | 38.09,10.8 38.1,10.79 38.41,10.79 RN1.5 38.44,10.07 40,8.51
  Top 0.406: IC2.14 41.76,8.64 | 41.27,8.51 41.66,8.51
  Top 0.508: 41.66,8.51 41.53,8.51
  Bottom 0.305: v22.22,32.7 22.22,26.04 25.4,22.86 25.4,20.32 24.77,19.69 24.77,18.26 23.97,17.46 23.97,12.22 25.72,10.48 25.72,6.35 29.21,6.35 29.53,6.03 v40,6.03
  pour Top (no thermals): 12.7,34.29 28.26,34.29 28.26,30.48 14.29,30.48 14.29,22.86 12.7,22.86 12.7,29.37 13.34,29.37 13.34,30.32 12.7,30.32

### Text on the board
tPlace: v.trocio | I+S 2010 | Ian Lesnet | 2010 | Jun | CC-BY-SA
tNames: PWR | USB | MODE | VREG | Bus Pirate v4.0
bNames: PWR | USB | MODE | VREG | BPv4.0 | DangerousPrototypes.com | GND | +5V | +3.3 | Vpu | ADC | AUX2 | Fulfillment by | AUX1 | AUX | Seeed Studio | www.seeedstudio.com | CS | MISO | CLK | MOSI | MCLR | +3.3V | GND | PGD | PGC
tValues: vimark
Reference: I/O header | EXT PWR | USB-OTG | V+ - GND | GND | +5v | +3v | Vpu | ADC | AUX2 | USB | AUX1 | AUX | CS | MISO | CLK | MOSI | MCLR | +3.3V | GND | DATA | CLOCK | BUS PIRATE V4.0 | CC-BY-SA | Ian Lesnet 2010 | Programming Header | http://dangerousprototypes.com